# EAGLE design KeyChaininoTHT (EAGLE 7.7.0)
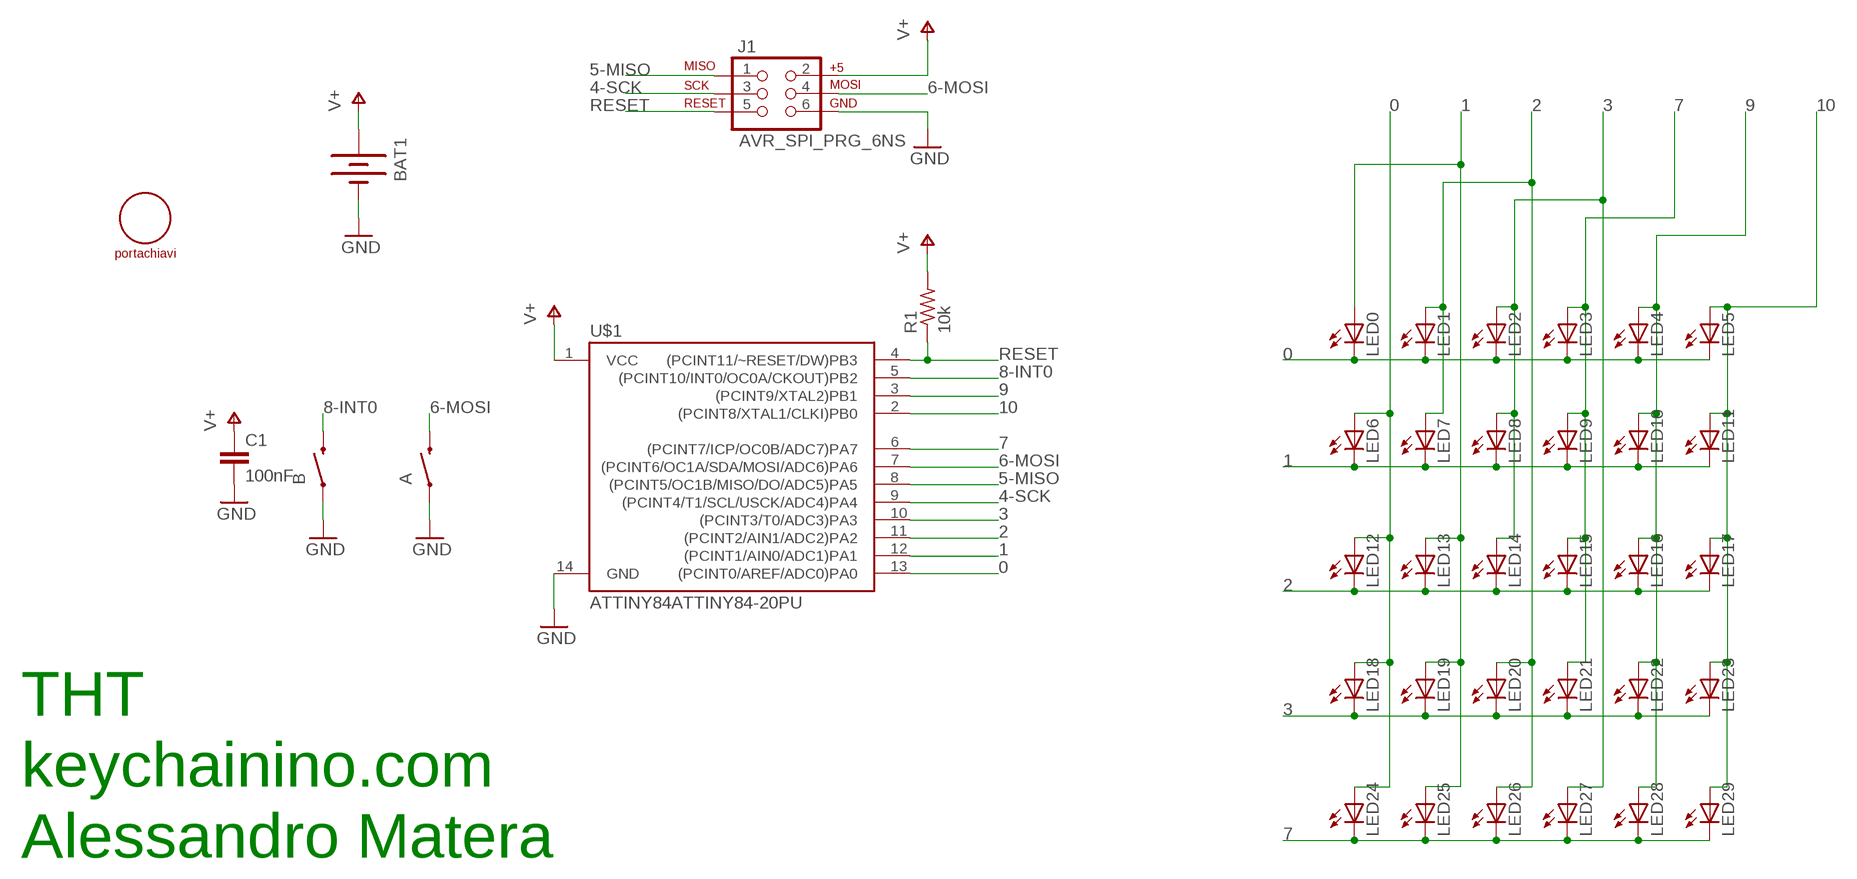
[diagram p0: schematic, sheet 1]

## Parts
A  SWITCH-MOMENTARY-2PTH  [TACTILE-PTH]
B  SWITCH-MOMENTARY-2PTH  [TACTILE-PTH]
BAT1  BATTERY20PTH  [BATTCOM_20MM_PTH]
C1  100nF  CAPPTH1  [CAP-PTH-5MM]
J1  AVR_SPI_PRG_6NS  [2X3-NS]
LED0  LED5MM-KIT  [LED5MM-KIT]
LED1  LED5MM-KIT  [LED5MM-KIT]
LED2  LED5MM-KIT  [LED5MM-KIT]
LED3  LED5MM-KIT  [LED5MM-KIT]
LED4  LED5MM-KIT  [LED5MM-KIT]
LED5  LED5MM-KIT  [LED5MM-KIT]
LED6  LED5MM-KIT  [LED5MM-KIT]
LED7  LED5MM-KIT  [LED5MM-KIT]
LED8  LED5MM-KIT  [LED5MM-KIT]
LED9  LED5MM-KIT  [LED5MM-KIT]
LED10  LED5MM-KIT  [LED5MM-KIT]
LED11  LED5MM-KIT  [LED5MM-KIT]
LED12  LED5MM-KIT  [LED5MM-KIT]
LED13  LED5MM-KIT  [LED5MM-KIT]
LED14  LED5MM-KIT  [LED5MM-KIT]
LED15  LED5MM-KIT  [LED5MM-KIT]
LED16  LED5MM-KIT  [LED5MM-KIT]
LED17  LED5MM-KIT  [LED5MM-KIT]
LED18  LED5MM-KIT  [LED5MM-KIT]
LED19  LED5MM-KIT  [LED5MM-KIT]
LED20  LED5MM-KIT  [LED5MM-KIT]
LED21  LED5MM-KIT  [LED5MM-KIT]
LED22  LED5MM-KIT  [LED5MM-KIT]
LED23  LED5MM-KIT  [LED5MM-KIT]
LED24  LED5MM-KIT  [LED5MM-KIT]
LED25  LED5MM-KIT  [LED5MM-KIT]
LED26  LED5MM-KIT  [LED5MM-KIT]
LED27  LED5MM-KIT  [LED5MM-KIT]
LED28  LED5MM-KIT  [LED5MM-KIT]
LED29  LED5MM-KIT  [LED5MM-KIT]
R1  10k  R-US_R1206  [R1206]
U$1  ATTINY84ATTINY84-20PU  [DIL14]
U$2  ANELLO-PORTACHIAVI  [HOLE-PORTACHIAVI]

## Nets
0: LED0.K(C) LED1.K(C) LED2.K(C) LED3.K(C) LED4.K(C) LED5.K(C) LED6.A LED12.A LED18.A LED24.A U$1.13((PCINT0/AREF/ADC0)PA0)
1: LED0.A LED6.K(C) LED7.K(C) LED8.K(C) LED9.K(C) LED10.K(C) LED11.K(C) LED13.A LED19.A LED25.A U$1.12((PCINT1/AIN0/ADC1)PA1)
2: LED1.A LED7.A LED12.K(C) LED13.K(C) LED14.K(C) LED15.K(C) LED16.K(C) LED17.K(C) LED20.A LED26.A U$1.11((PCINT2/AIN1/ADC2)PA2)
3: LED2.A LED8.A LED14.A LED18.K(C) LED19.K(C) LED20.K(C) LED21.K(C) LED22.K(C) LED23.K(C) LED27.A U$1.10((PCINT3/T0/ADC3)PA3)
4-SCK: J1.3 U$1.9((PCINT4/T1/SCL/USCK/ADC4)PA4)
5-MISO: J1.1 U$1.8((PCINT5/OC1B/MISO/DO/ADC5)PA5)
6-MOSI: A.3 J1.4 U$1.7((PCINT6/OC1A/SDA/MOSI/ADC6)PA6)
7: LED3.A LED9.A LED15.A LED21.A LED24.K(C) LED25.K(C) LED26.K(C) LED27.K(C) LED28.K(C) LED29.K(C) U$1.6((PCINT7/ICP/OC0B/ADC7)PA7)
8-INT0: B.3 U$1.5((PCINT10/INT0/OC0A/CKOUT)PB2)
9: LED4.A LED10.A LED16.A LED22.A LED28.A U$1.3((PCINT9/XTAL2)PB1)
10: LED5.A LED11.A LED17.A LED23.A LED29.A U$1.2((PCINT8/XTAL1/CLKI)PB0)
GND: A.1 B.1 BAT1.2(-) C1.2 J1.6 U$1.14(GND)
RESET: J1.5 R1.1 U$1.4((PCINT11/~RESET/DW)PB3)
V+: BAT1.1(+) C1.1 J1.2 R1.2 U$1.1(VCC)

## Notes on the sheet
- THT
- keychainino.com
- Alessandro Matera

## Library data of the parts
A B = SparkFun-Electromechanical:SWITCH-MOMENTARY-2: Various NO switches- pushbuttons, reed, etc
BAT1 = SparkFun-Electromechanical:BATTERY: Battery Holders Various common sizes : AA, AAA, 20mm coin cell and 12mm coin cell. 20MM_4LEGS, BATT-10373
C1 = SparkFun-Passives:CAP: Capacitor Standard 0603 ceramic capacitor, and 0.1" leaded capacitor.
J1 = SparkFun-Connectors:AVR_SPI_PRG_6: AVR ISP 6 Pin This is the reduced ISP connector for AVR programming. Common on Arduino. This footprint will take up less PCB space and can be used with a 10-pin to 6-pin adapter such as SKU: BOB-08508
LED0 LED1-LED29 = SparkFun-LED:LED: LEDs Standard schematic elements and footprints for 5mm, 3mm, 1206, and 0603 sized LEDs. 5mm - Spark Fun Electronics SKU : COM-00529 (and others)
R1 = adafruit:R-US_: RESISTOR, American symbol
U$1 = SparkFun-DigitalIC:ATTINY84: Atmel 14-pin 2/4/8kB flash uC
U$2 = anello-portachiavi:ANELLO-PORTACHIAVI

## Board
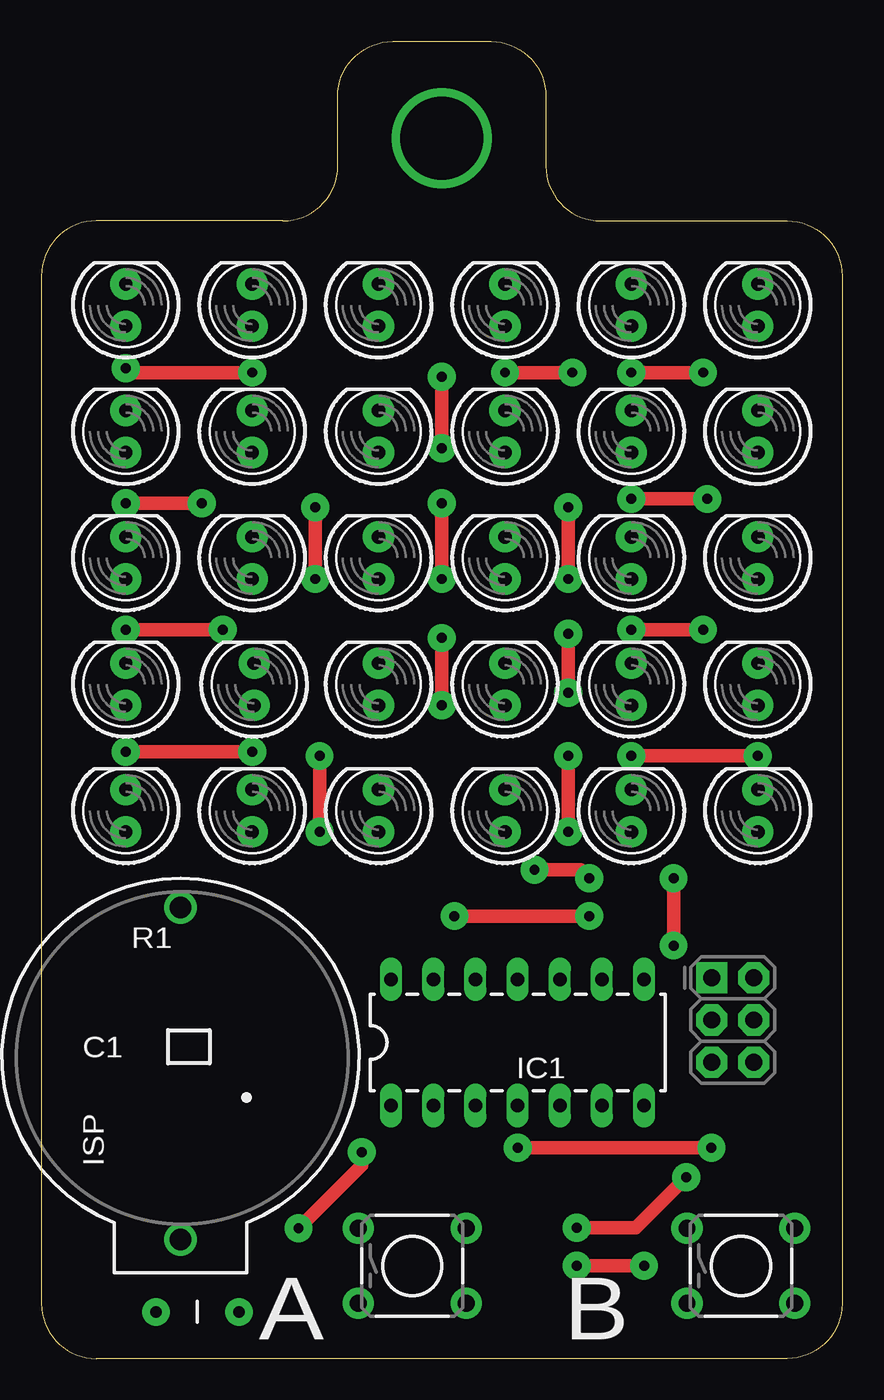
[diagram p1: board, top side]
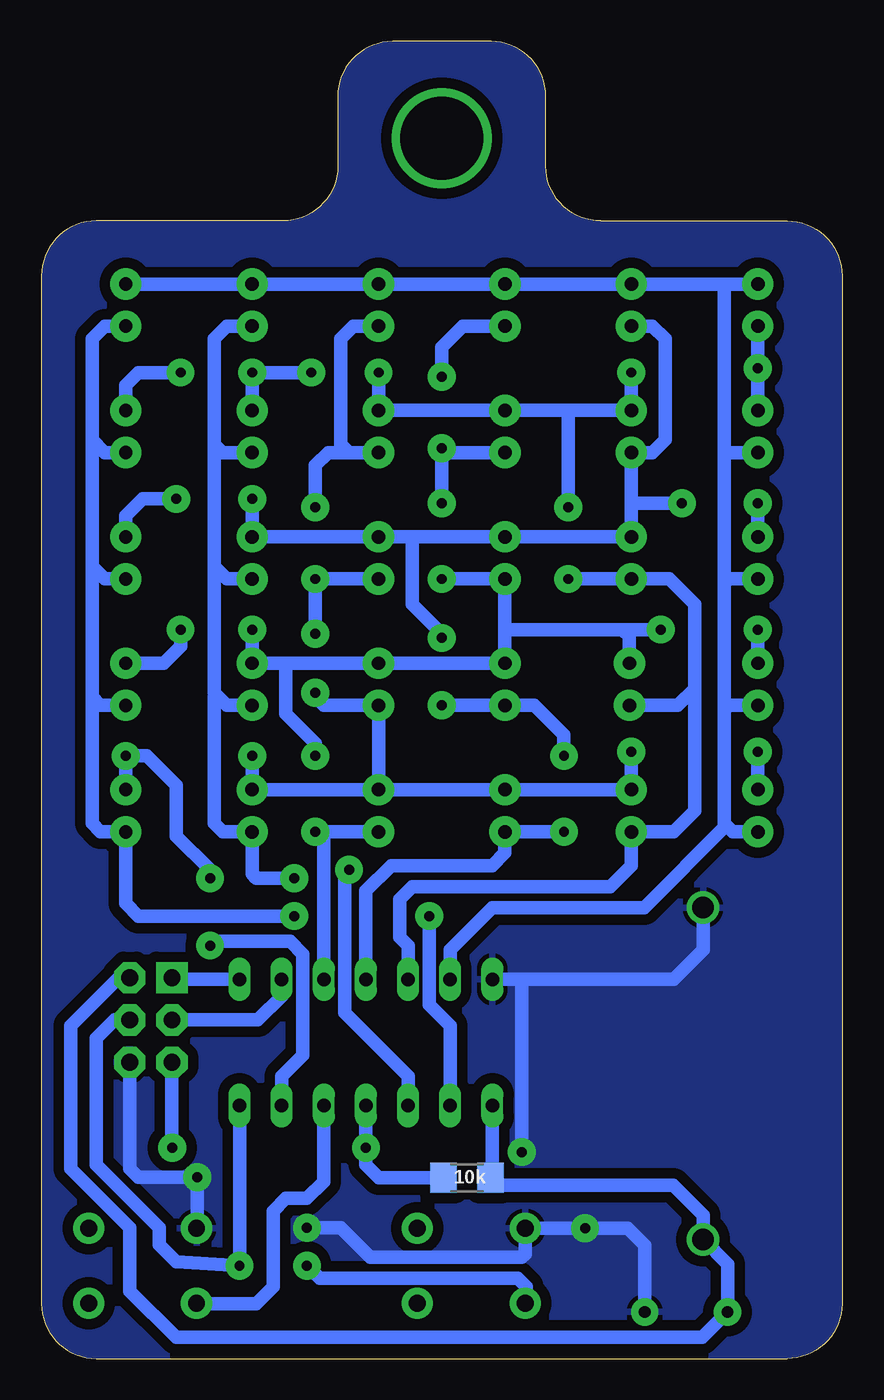
[diagram p2: board, bottom side, seen from below]

Size 48.26 x 79.39 mm. Coordinates in mm from the lower left corner, seen from the top.
Outline: 0,65.28 0,3.3 arc90 3.3,0 44.96,0 arc90 48.26,3.3 48.26,65.28 arc90 44.96,68.58 33.7,68.58 arc-90 30.4,71.88 30.4,76.09 arc90 27.1,79.39 21.16,79.39 arc90 17.86,76.09 17.86,71.88 arc-90 14.56,68.58 3.3,68.58 arc90 0,65.28
Copper layers (1*16): Top 0.035mm / dielectric 1.5mm / Bottom 0.035mm
Design rules "default *": minimum track width 6mil, minimum drill 12mil, track to track 25mil, track to pad 25mil, pad to pad 25mil, via to via 25mil, smd to smd 25mil, copper to edge 1mil, drill to drill 1mil, minimum pad ring 10mil, minimum via ring 6mil, stop-mask expansion 2mil, vias tented up to drill 100mil, thermal gap 10mil

### Footprints (pad centres in the part's own frame; a part is rotated, then mirrored left to right if it is on the bottom)
TACTILE-PTH = drill 1.016 pad 1.88: 1 -3.251,2.261; 2 3.251,2.261; 3 -3.251,-2.261; 4 3.251,-2.261
BATTCOM_20MM_PTH = drill 1.3: 1 20,0; 2 0,0
CAP-PTH-5MM = drill 0.7 pad 1.651: 1 -2.5,0; 2 2.5,0
2X3-NS = drill 1.016 pad 1.88 square: 1 -2.54,-1.27 | drill 1.016 pad 1.88 octagon: 2 -2.54,1.27; 3 0,-1.27; 4 0,1.27; 5 2.54,-1.27; 6 2.54,1.27
LED5MM-KIT = drill 0.813 pad 1.88: A -1.27,0; K 1.27,0
R1206 = smd 1.6 x 1.803: 1 -1.422,0; 2 1.422,0
DIL14 = drill 0.813 long: 1 -8.89,-3.81; 2 -6.35,-3.81; 3 -3.81,-3.81; 4 -1.27,-3.81; 5 1.27,-3.81; 6 3.81,-3.81; 7 6.35,-3.81; 8 6.35,3.81; 9 3.81,3.81; 10 1.27,3.81; 11 -1.27,3.81; 12 -3.81,3.81; 13 -6.35,3.81; 14 -8.89,3.81
HOLE-PORTACHIAVI = drill 5 pad 6: P$1 0,0

### Placement (x,y rotation side)
A  22.35,5.59 0 top
B  42.16,5.59 0 top
BAT1  8.38,27.18 270 top
C1  9.4,2.81 0 top
J1  41.66,20.41 270 top
LED0  5.08,63.5 90 top
LED1  12.7,63.5 90 top
LED2  20.32,63.5 90 top
LED3  27.94,63.5 90 top
LED4  35.56,63.5 90 top
LED5  43.18,63.5 90 top
LED6  5.08,55.88 90 top
LED7  12.7,55.88 90 top
LED8  20.32,55.88 90 top
LED9  27.94,55.88 90 top
LED10  35.56,55.88 90 top
LED11  43.18,55.88 90 top
LED12  5.08,48.26 90 top
LED13  12.7,48.26 90 top
LED14  20.32,48.26 90 top
LED15  27.94,48.26 90 top
LED16  35.56,48.26 90 top
LED17  43.18,48.26 90 top
LED18  5.08,40.64 90 top
LED19  12.82,40.64 90 top
LED20  20.32,40.64 90 top
LED21  27.94,40.64 90 top
LED22  35.56,40.64 90 top
LED23  43.18,40.64 90 top
LED24  5.08,33.02 90 top
LED25  12.7,33.02 90 top
LED26  20.32,33.02 90 top
LED27  27.94,33.02 90 top
LED28  35.56,33.02 90 top
LED29  43.18,33.02 90 top
R1  22.61,10.91 0 bottom
U$1  29.97,19.05 0 top
U$2  24.13,73.56 0 top

### Tracks (layer width: path | path; a pad name or v marks a point on that pad's centre or on a via)
0
  Bottom 0.813: LED0.K 7.37,64.77 | 7.37,64.77 LED1.K LED2.K LED3.K LED4.K LED5.K | LED24.A 6.6,31.75 6.99,32.13 | 6.99,32.13 7.11,32.26 7.11,39.12 | 7.11,39.12 7.11,46.74 | 7.11,46.74 7.11,54.61 | 7.11,54.61 7.11,64.52 7.37,64.77 | LED6.A 7.11,54.61 | LED12.A 6.86,46.99 7.11,46.74 | LED18.A 6.86,39.37 7.11,39.12 | U$1.13 23.62,24.64 21.08,27.18 11.94,27.18 6.99,32.13
1  (via drill 0.6 pad 1.68)
  Top 0.813: v35.56,59.44 v39.88,59.44 | v27.94,59.44 v32,59.44 | v12.7,59.44 5.33,59.44 v5.08,59.69 | v16.51,46.99 v16.51,51.31
  Bottom 0.813: LED6.K v5.08,59.69 LED0.A | LED19.A 9.91,39.37 8.89,40.39 | 8.89,40.39 8.89,45.47 10.41,46.99 LED13.A v16.51,46.99 | 8.89,40.39 8.89,33.02 10.16,31.75 LED25.A 12.7,29.72 13.97,28.45 25.91,28.45 26.67,27.69 26.67,25.4 26.16,24.89 U$1.12 | 16.76,57.15 LED7.K v12.7,59.44 | 16.76,57.15 LED8.K LED9.K v27.94,59.44 | LED10.K v35.56,59.44 v32,59.44 | v39.88,59.44 42.42,59.44 43.18,58.67 LED11.K | v16.51,51.31 16.51,56.9 16.76,57.15
2  (via drill 0.6 pad 1.68)
  Top 0.813: v40.13,51.82 v35.56,51.82 | v5.08,51.56 v9.65,51.56 | v24.13,39.37 v24.13,43.43 | v16.76,31.75 v16.76,36.32
  Bottom 0.813: 12.7,51.31 LED13.K LED14.K 25.91,49.53 | 12.7,51.31 LED7.A 11.43,54.61 10.67,55.37 10.67,61.47 11.43,62.23 LED1.A | 25.91,49.53 LED15.K | 28.45,49.53 LED15.K | LED15.K LED16.K v35.56,51.82 | LED17.K 43.18,50.8 42.16,51.82 v40.13,51.82 | LED12.K v5.08,51.56 | v9.65,51.56 12.45,51.56 12.7,51.31 | v24.13,39.37 LED20.A 18.54,39.37 16.76,37.59 v16.76,36.32 | v24.13,43.43 24.13,43.69 25.91,45.47 25.91,49.53 | v16.76,31.75 LED26.A 20.32,30.48 21.08,29.72 27.18,29.72 28.7,28.19 U$1.11
3  (via drill 0.6 pad 1.68)
  Top 0.813: v5.08,43.94 v10.92,43.94 | v24.13,54.86 v24.13,59.18 | v24.13,46.99 v24.13,51.56 | v35.56,43.94 v39.88,43.94 | v31.75,31.75 v31.75,36.32
  Bottom 0.813: LED18.K v5.08,43.94 | v10.92,43.94 13.21,43.94 | 13.21,43.94 20.32,43.94 | 20.32,43.94 LED14.A v24.13,46.99 | LED19.K 12.82,43.55 13.21,43.94 | 20.32,43.94 LED20.K LED21.K 33.78,41.91 | 33.78,41.91 LED22.K v35.56,43.94 | v24.13,59.18 24.13,60.96 22.86,62.23 LED2.A | 20.83,54.61 LED8.A 23.88,54.61 v24.13,54.86 v24.13,51.56 | v39.88,43.94 39.88,42.93 40.89,41.91 LED23.K | LED27.A v31.75,31.75 31.24,31.24 U$1.10 | v31.75,36.32 31.75,37.08 33.53,38.86 33.53,41.66 33.78,41.91
4-SCK
  Bottom 0.813: J1.3 35.22,20.41 33.78,21.84 U$1.9
5-MISO
  Bottom 0.813: U$1.8 40.31,22.86 J1.1
6-MOSI  (via drill 0.6 pad 1.68)
  Top 0.813: v36.32,5.59 v32.26,5.59
  Bottom 0.813: U$1.7 v36.32,5.59 40.13,5.84 41.15,6.86 41.15,7.87 44.96,11.68 44.96,19.3 43.85,20.41 J1.4 | 19.05,3.38 A.3 19.05,3.28 19.05,4.32 19.56,4.83 31.5,4.83 v32.26,5.59
7  (via drill 0.6 pad 1.68)
  Top 0.813: v5.08,36.58 v12.7,36.58 | v43.18,36.32 v35.56,36.32 | v31.75,43.69 v31.75,40.13 | v31.75,51.31 v31.75,46.99 | v38.1,24.89 v38.1,28.96
  Bottom 0.813: LED24.K v5.08,36.58 | v12.7,36.58 LED25.K LED26.K LED27.K | LED27.K LED21.A 31.24,39.37 31.75,39.88 v31.75,40.13 | LED27.K LED28.K v35.56,36.32 | LED29.K v43.18,36.32 41.91,36.32 40.13,34.54 40.13,31.5 38.1,29.46 v38.1,28.96 | LED3.A 29.46,62.23 30.23,61.47 30.23,55.12 29.72,54.61 LED9.A 30.99,54.61 31.75,53.85 v31.75,51.31 | LED15.A v31.75,46.99 v31.75,43.69 | U$1.6 33.78,17.02 32.51,18.29 32.51,24.38 33.27,25.15 37.85,25.15 v38.1,24.89
8-INT0
  Bottom 0.813: U$1.5 31.24,10.67 32.26,9.65 33.53,9.65 34.29,8.89 34.29,4.32 35.31,3.3 38.89,3.3 B.3
9  (via drill 0.6 pad 1.68)
  Top 0.813: v29.72,29.46 32.51,29.46 v33.02,28.96
  Bottom 0.813: LED4.A 37.08,62.23 37.85,61.47 37.85,55.12 | 37.85,55.12 37.34,54.61 LED10.A | LED16.A 37.08,46.99 37.85,47.75 | 37.85,47.75 37.85,55.12 | LED22.A 37.08,39.37 37.72,40.01 | 37.72,40.01 37.85,40.13 37.85,47.75 | 37.72,40.01 37.85,39.88 37.85,32.26 37.34,31.75 LED28.A 35.56,29.21 35.31,28.96 v33.02,28.96 | U$1.3 26.16,17.02 29.97,20.83 29.97,29.21 v29.72,29.46
10  (via drill 0.6 pad 1.68)
  Top 0.813: v24.89,26.67 v33.02,26.67
  Bottom 0.813: LED5.A 44.45,62.23 45.21,61.47 45.21,55.37 | 45.21,55.37 44.45,54.61 LED11.A | LED17.A 44.45,46.99 45.21,47.75 | 45.21,47.75 45.21,55.37 | LED23.A 44.7,39.37 45.21,39.88 | 45.21,39.88 45.21,47.75 | 45.21,39.88 45.21,32.26 44.7,31.75 LED29.A 43.18,27.43 42.42,26.67 v33.02,26.67 | U$1.2 23.62,20.07 24.89,21.34 v24.89,26.67
GND  (via drill 0.6 pad 1.68)
  Top 0.813: v19.3,12.45 19.3,11.66 v15.49,7.85 | v32.26,7.87 35.81,7.87 v38.86,10.92
  Bottom 0.813: 19.3,22.86 10.16,22.86 8.38,24.64 BAT1.2 | C1.2 11.9,6.82 12.93,7.85 v15.49,7.85 A.1 19.1,6.3 19.3,6.1 28.45,6.1 30.23,7.87 v32.26,7.87 | U$1.14 19.3,22.86 | 19.3,22.86 v19.3,12.45 | B.1 38.86,7.9 v38.86,10.92 42.42,10.92 42.93,11.44 J1.6
  pour Bottom: -2.32,81.01 51.02,81.01 51.02,-1.79 -2.32,-1.79
RESET  (via drill 0.6 pad 1.68)
  Top 0.813: v40.39,12.7 v28.7,12.7
  Bottom 0.813: R1.1 27.92,10.91 28.7,11.68 v28.7,12.7 U$1.4 | J1.5 40.39,12.71 v40.39,12.7
V+
  Bottom 0.813: U$1.1 21.08,10.94 21.15,10.94 R1.2 20.71,10.43 10.18,10.43 8.38,8.64 BAT1.1 6.9,5.69 C1.1 8.44,1.27 40.13,1.27 42.93,4.06 42.93,7.87 46.48,11.43 46.48,20.07 43.6,22.95 J1.2

### Text on the board
tPlace: R1 | C1 | IC1 | ISP | A | B